# Altium schematic sheet ESD_Protector.SchDoc: ESD Protector
size A4
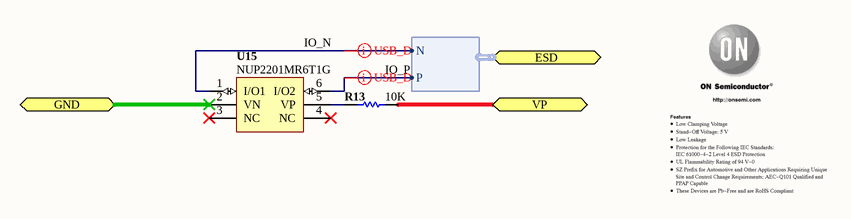
[diagram p0: ESD_Protector.SchDoc]

## Parts
R13  10K  [RESC0402(1005)_N]
U15  NUP2201MR6T1G  [ONSC-318G-02]

## Ports
ESD (harness USB), GND, VP

## Harnesses
USB: N, P

## Nets
GND: U15.2(VN) ; port GND
IO_N: U15.1(I/O1) ; port ESD.N
IO_P: U15.6(I/O2) ; port ESD.P
VP: R13.1 ; port VP
NetR13_2: R13.2 U15.5(VP)

Not connected (* = marked no-connect by the designer): U15 3(NC)* 4(NC)*

## Layout directives
differential pair: IO_N, IO_P

## Notes on the sheet
- Sheet Title
- Project Title
- Size:
- Date:
- A4
- Item:
- Time:
- Revision:
- Sheet
- of
- File:

## Library data of the parts
R13 = CMP-1011-00623-1: 10K 0.063W 1% 0402 (1005 Metric)  SMD; Case-Metric: 1005; Value: 10000.00 Ohm; Case-EIA: 0402; Tolerance: 1 %; Technology: SMT; Power: 0.063 W
U15 = CMP-5150-00000-1: IC TVS DIODE ARRAY HS LINE 6TSOP; Class: Discrete; Peak Power Dissipation: 500 W; Storage Temperature: -55 to 125 degC; Datasheet: http://www.onsemi.cn/pub_link/Collateral/NUP2201MR6-D.PDF